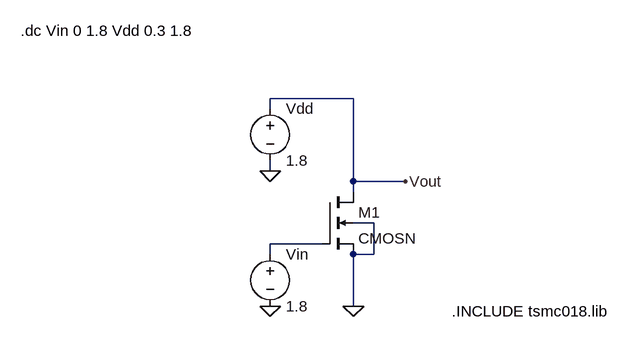
[diagram p0: schematic cmosn.asc]
cmosn.asc, the LTspice schematic file:
Version 4
SHEET 1 900 680
WIRE 512 176 384 176
WIRE 384 192 384 176
WIRE 384 288 384 272
WIRE 512 304 512 176
WIRE 592 304 512 304
WIRE 512 320 512 304
WIRE 544 368 512 368
WIRE 464 400 384 400
WIRE 384 416 384 400
WIRE 544 416 544 368
WIRE 544 416 512 416
WIRE 512 496 512 416
FLAG 512 496 0
FLAG 384 496 0
FLAG 384 288 0
FLAG 592 304 Vout
SYMBOL cmosn 464 320 R0
SYMATTR InstName M1
SYMBOL voltage 384 176 R0
SYMATTR InstName Vdd
SYMATTR Value 1.8
SYMBOL voltage 384 400 R0
SYMATTR InstName Vin
SYMATTR Value 1.8
TEXT 664 504 Left 2 !.INCLUDE tsmc018.lib
TEXT 0 72 Left 2 !.dc Vin 0 1.8 Vdd 0.3 1.8

The netlist it stands for:
* cmosn.asc
M1 Vout N001 0 0 CMOSN
Vdd Vout 0 1.8
Vin N001 0 1.8
.model NMOS NMOS
.model PMOS PMOS
.lib standard.mos
.INCLUDE tsmc018.lib
.dc Vin 0 1.8 Vdd 0.3 1.8
.backanno
.end